# Altium project Project Pegasus (12V 10A MD).PrjPcb
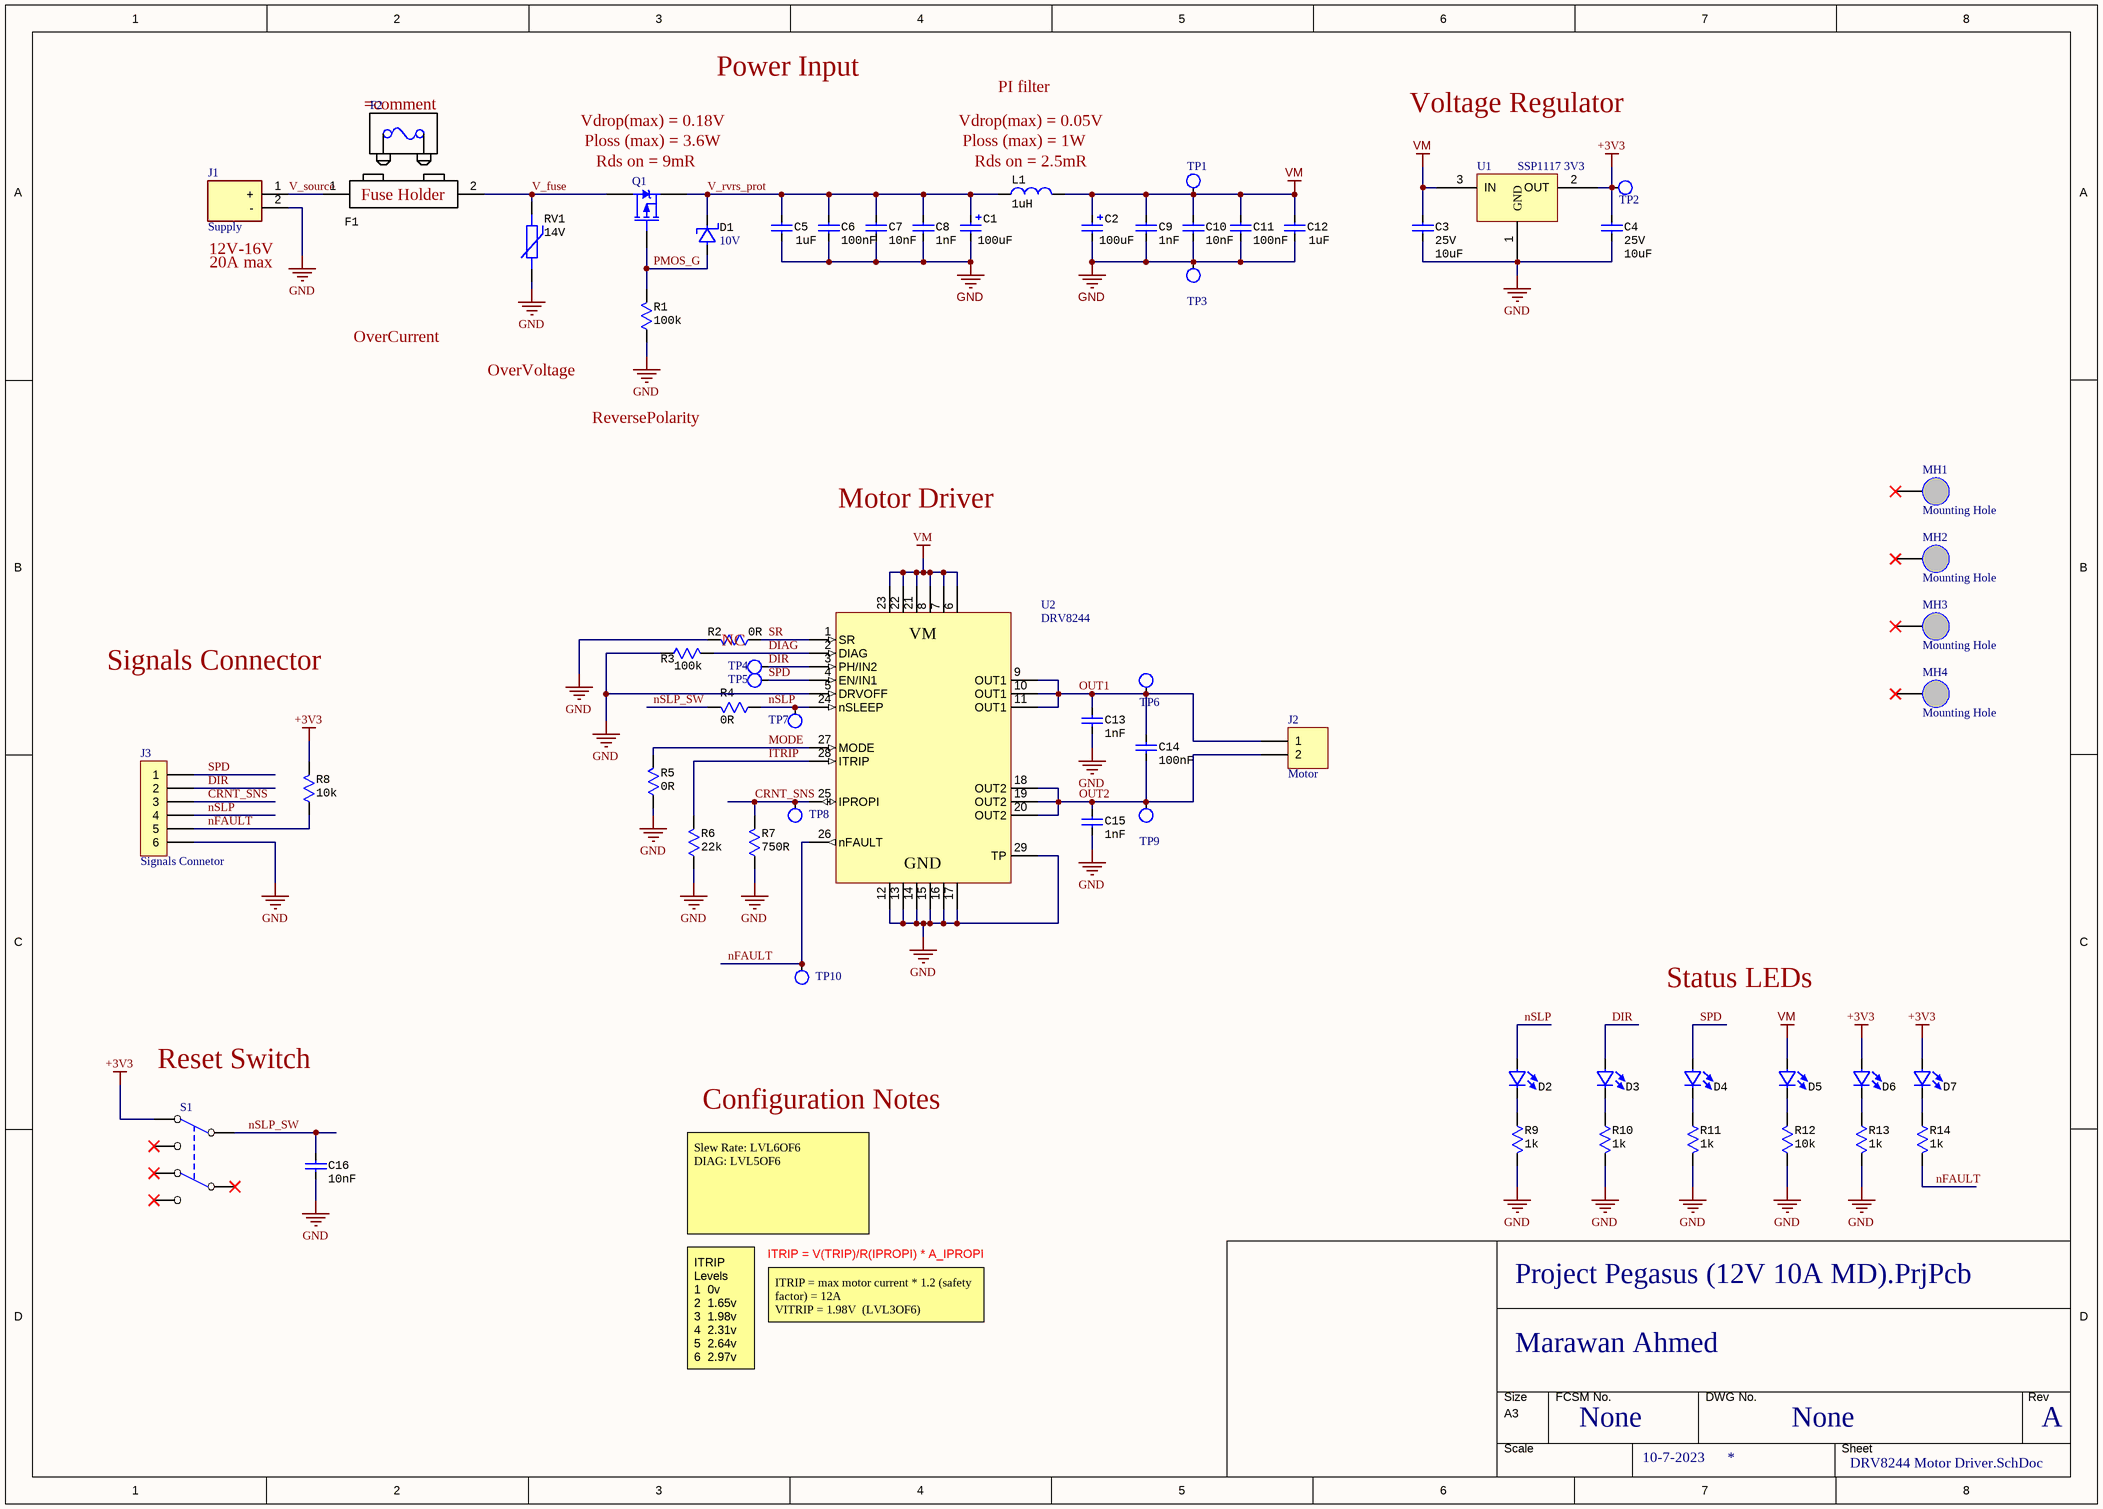
[diagram p0: DRV8244 Motor Driver.SchDoc]
1 sheet, 62 parts. Net scope: global (net labels, ports and power ports of the same name join across sheets).
Board file: DRV8244 Motor Driver.PcbDoc

## Sheet DRV8244 Motor Driver.SchDoc: DRV8244 Motor Driver
size A3; Date: 10-7-2023; Author: Marawan Ahmed; Revision: A; SheetNumber: 1; SheetTotal: 1

### Parts
C1  100uF  [CAP Electrolytic SMD G_10X10.3X10.2(CPOL-EU153CLV-1010)]
C2  100uF  [CAP Electrolytic SMD G_10X10.3X10.2(CPOL-EU153CLV-1010)]
C3  Voltage: 25V  [CAP Ceramic SMD 1206]  (hidden comment: 10uF)
C4  Voltage: 25V  [CAP Ceramic SMD 1206]  (hidden comment: 10uF)
C5  1uF  [CAP Ceramic SMD 0603]
C6  100nF  [CAP Ceramic SMD 0603]
C7  10nF  [CAP Ceramic SMD 0603]
C8  1nF  [CAP Ceramic SMD 0603]
C9  1nF  [CAP Ceramic SMD 0603]
C10  10nF  [CAP Ceramic SMD 0603]
C11  100nF  [CAP Ceramic SMD 0603]
C12  1uF  [CAP Ceramic SMD 0603]
C13  1nF  [CAP Ceramic SMD 0603]
C14  100nF  [CAP Ceramic SMD 0603]
C15  1nF  [CAP Ceramic SMD 0603]
C16  10nF  [CAP Ceramic SMD 0603]
D1  10V  [Diode Single SMD SOD123]
D2  (no value)  [LED SMD 0805G]
D3  (no value)  [LED SMD 0805G]
D4  (no value)  [LED SMD 0805G]
D5  (no value)  [LED SMD 0805R]
D6  (no value)  [LED SMD 0805R]
D7  (no value)  [LED SMD 0805B]
F1  XF-508P-A  [FUSE-TH_L19.8-W7.0_XF-508P-A]  (value not drawn)
F2  25A  (value not drawn)  (mechanical)
J1  Supply  [XT60PW-M]
J2  Motor  [Connector screw terminal Block TH 1x2 9.5 WJ46-B]
J3  Signals Connetor  [XH-6/2.5mm]
L1  1uH  [IND SMD SRP1265A]
MH1  Mounting Hole  [Connector Mounting hole th 3.5mm]  (no BOM)
MH2  Mounting Hole  [Connector Mounting hole th 3.5mm]  (no BOM)
MH3  Mounting Hole  [Connector Mounting hole th 3.5mm]  (no BOM)
MH4  Mounting Hole  [Connector Mounting hole th 3.5mm]  (no BOM)
Q1  HYG110P04LQ2C2  [PQFN 5x6]  (value not drawn)
R1  100k  [RES SMD 0603]
R2  0R  [RES SMD 0603]
R3  100k  [RES SMD 0603]
R4  0R  [RES SMD 0603]
R5  0R  [RES SMD 0603]
R6  22k  [RES SMD 0603]
R7  750R  [RES SMD 0603]
R8  value 10k  [RES SMD 0603]  (hidden comment: 10kR)
R9  value 1k  [RES SMD 0603]  (hidden comment: 1kR)
R10  value 1k  [RES SMD 0603]  (hidden comment: 1kR)
R11  value 1k  [RES SMD 0603]  (hidden comment: 1kR)
R12  value 10k  [RES SMD 0603]  (hidden comment: 10kR)
R13  value 1k  [RES SMD 0603]  (hidden comment: 1kR)
R14  value 1k  [RES SMD 0603]  (hidden comment: 1kR)
RV1  14V  [VAR 7.5mm]
S1  PB-22E86C  [SWP-KFT DIP-8X8]  (value not drawn)
TP1  TestPoint  [TestPoint Surface 0.8mm]  (value not drawn)  (no BOM)
TP2  TestPoint  [TestPoint Surface 0.8mm]  (value not drawn)  (no BOM)
TP3  TestPoint  [TestPoint Surface 0.8mm]  (value not drawn)  (no BOM)
TP4  TestPoint  [TestPoint Surface 0.8mm]  (value not drawn)  (no BOM)
TP5  TestPoint  [TestPoint Surface 0.8mm]  (value not drawn)  (no BOM)
TP6  TestPoint  [TestPoint Surface 0.8mm]  (value not drawn)  (no BOM)
TP7  TestPoint  [TestPoint Surface 0.8mm]  (value not drawn)  (no BOM)
TP8  TestPoint  [TestPoint Surface 0.8mm]  (value not drawn)  (no BOM)
TP9  TestPoint  [TestPoint Surface 0.8mm]  (value not drawn)  (no BOM)
TP10  TestPoint  [TestPoint Surface 0.8mm]  (value not drawn)  (no BOM)
U1  SSP1117 3V3  [Linear reagulator SMD AMS1117]
U2  DRV8244  [DRV8244]

### Nets
+3V3: C4.1 D6.1 D7.1 R8.2 S1.1 TP2.1 U1.2(OUT)
GND: C1.2 C2.2 C3.2 C4.2 C5.2 C6.2 C7.2 C8.2 C9.2 C10.2 C11.2 C12.2 C13.2 C15.2 C16.2 J1.2(-) J3.6 R1.1 R2.2 R3.1 R5.1 R6.1 R7.1 R9.2 R10.2 R11.2 R12.1 R13.2 RV1.1 TP3.1 U1.1(GND) U2.5(DRVOFF) U2.12(GND) U2.13(GND) U2.14(GND) U2.15(GND) U2.16(GND) U2.17(GND) U2.29(TP)
VM: C2.1 C3.1 C9.1 C10.1 C11.1 C12.1 D5.1 L1.1 TP1.1 U1.3(IN) U2.6(VM) U2.7(VM) U2.8(VM) U2.21(VM) U2.22(VM) U2.23(VM)
CRNT_SNS: J3.3 R7.2 TP8.1 U2.25(IPROPI)
DIAG: R3.2 U2.2(DIAG)
DIR: D3.1 J3.2 TP4.1 U2.3(PH/IN2)
ITRIP: R6.2 U2.28(ITRIP)
MODE: R5.2 U2.27(MODE)
nFAULT: J3.5 R8.1 R14.2 TP10.1 U2.26(nFAULT)
nSLP: D2.1 J3.4 R4.1 TP7.1 U2.24(nSLEEP)
nSLP_SW: C16.1 R4.2 S1.2
OUT1: C13.1 C14.1 J2.1 TP6.1 U2.9(OUT1) U2.10(OUT1) U2.11(OUT1)
OUT2: C14.2 C15.1 J2.2 TP9.1 U2.18(OUT2) U2.19(OUT2) U2.20(OUT2)
PMOS_G: D1.1 Q1.1(G) R1.2
SPD: D4.1 J3.1 TP5.1 U2.4(EN/IN1)
SR: R2.1 U2.1(SR)
V_fuse: F1.2 Q1.2(D) RV1.2
V_rvrs_prot: C1.1 C5.1 C6.1 C7.1 C8.1 D1.2 L1.2 Q1.3(S)
V_source: F1.1 J1.1(+)
NetD2_2: D2.2 R9.1
NetD3_2: D3.2 R10.1
NetD4_2: D4.2 R11.1
NetD5_2: D5.2 R12.2
NetD6_2: D6.2 R13.1
NetD7_2: D7.2 R14.1

Not connected (* = marked no-connect by the designer): MH1 1*; MH2 1*; MH3 1*; MH4 1*; S1 3* 4* 5* 6*

### Notes on the sheet
- Power Input
- PI filter
- (near Q1) Rds on = 9mR
- (near Q1) Ploss (max) = 3.6W
- Vdrop(max) = 0.18V
- (near L1) Ploss (max) = 1W
- (near L1) Rds on = 2.5mR
- Vdrop(max) = 0.05V
- Voltage Regulator
- (near J1) 12V-16V
- (near J1) 20A max
- OverCurrent
- OverVoltage
- ReversePolarity
- Motor Driver
- (near R2) NC
- Signals Connector
- Status LEDs
- (near S1) Reset Switch
- Configuration Notes
- Slew Rate: LVL6OF6
  DIAG: LVL5OF6
- ITRIP = V(TRIP)/R(IPROPI) * A_IPROPI
- ITRIP = max motor current * 1.2 (safety factor) = 12A
  VITRIP = 1.98V  (LVL3OF6)
- ITRIP Levels
  1  0v
  2  1.65v
  3  1.98v
  4  2.31v
  5  2.64v
  6  2.97v
- None
- THIS DOCUMENT AND THE DATA DISCLOSED HEREIN OR
- HEREWITH IS THE PROPERTY OF ALTIUM LIMITED AND MAY
- DWG NO:
- REVISION
- REV:
- DESCRIPTION
- DATE
- APPROVED
- BE FREELY DISTRIBUTED IN WHOLE. NO RIGHTS ARE
- RESERVED OR EXPRESS OR IMPLIED WARANTEE GIVEN.
- ENG:
- APPROVALS
- PROJECT
- DSN:
- CHK:
- REFERENCE DOCUMENTS
- PROJECT REVISION:
- TITLE
- DOCUMENT REVISION:
- DESIGN ITEM:
- BOM:
- FAB DWG:
- PCB DWG:
- ASSY DWG:
- SCALE:
- A3
- SIZE
- CAGE CODE
- FILE NAME
- DWG NO.
- SHEET
- OF
- REV
- (in symbol Fuse Automotive holder) Fuse Holder

### Library data of the parts
C1 C2 = CAP ELEC 100uF 68V: -40℃~+105℃ 2000hrs@105℃ 100uF 10.2mm 63V 10mm ±20% SMD,D10xL10.2mm Aluminum Electrolytic Capacitors - SMD ROHS; Manufacturer: ROQANG; Manufacturer Part Number: RT1J101M1010; ComponentLink1Description: Datasheet; ComponentLink1URL: https://datasheet.lcsc.com/lcsc/1809061214_Nichicon-UWX1C101MCL1GB_C111600.pdf; Supplier: LCSC; Supplier Part Number: C280414; Capacitance: 100uF
C3 C4 = CAP 1206 10uF 25V: Ceramic capacitor SMD-1206 10000nF (10uF) /25V X7R# K 10%, Samsung, RoHS/4k/; Manufacturer Part Number: CL31B106KAHNNNE; Dielectric: X7R; Manufacturer: Samsung; RoHS: Yes; Category: Ceramic Capacitors; Stock 1: 663420; Pricing 1: 20=0.033200, 200=0.025500, 600=0.022100, 2000=0.019600, 10000=0.018600, 20000=0.017900 (AUD); Mount: Surface Mount; Case/Package: 1206; Case Code (Imperial): 1206; Case Code (Metric): 3216; Min Operating Temperature: -55°C; Max Operating Temperature: 125°C; Capacitance: 10uF; Tolerance: 10%; Voltage Rating: 25V; Packaging: Tape and Reel; Package Quantity: 1; Length: 3.2mm; Width: 0.063inch; Height: 1.6mm; Thickness: 0.071inch; RoHS Compliant: Yes; ComponentLink1URL: https://datasheet.ciiva.com/25795/cl31b106kahnnne-25795260.pdf?src-supplier=Digi-Key; ComponentLink1Description: https://datasheet.ciiva.com/25795/cl31b106kahnnne-25795260.pdf?src-supplier=Digi-Key; ComponentLink2URL: https://datasheet.ciiva.com/26838/getdatasheetpartid-356415-26838914.pdf?src-supplier=Verical; ComponentLink2Description: https://datasheet.ciiva.com/26838/getdatasheetpartid-356415-26838914.pdf?src-supplier=Verical; ComponentLink3URL: https://datasheet.ciiva.com/16498/cl03a105mq3csnc-16498474.pdf?src-supplier=Future+Electronics; ComponentLink3Description: https://datasheet.ciiva.com/16498/cl03a105mq3csnc-16498474.pdf?src-supplier=Future+Electronics; Value: 10uF; Depth: 1.6mm; ComponentLink10URL: https://datasheet.ciiva.com/25795/cl31b106kahnnne-25795260.pdf?src-supplier=Digi-Key; ComponentLink10Description: https://datasheet.ciiva.com/25795/cl31b106kahnnne-25795260.pdf?src-supplier=Digi-Key; ComponentLink11URL: https://datasheet.ciiva.com/26838/getdatasheetpartid-356415-26838914.pdf?src-supplier=Verical; ComponentLink11Description: https://datasheet.ciiva.com/26838/getdatasheetpartid-356415-26838914.pdf?src-supplier=Verical; ComponentLink12URL: https://datasheet.ciiva.com/16498/cl03a105mq3csnc-16498474.pdf?src-supplier=Future+Electronics; ComponentLink12Description: https://datasheet.ciiva.com/16498/cl03a105mq3csnc-16498474.pdf?src-supplier=Future+Electronics; Series: CL; Construction: Flat; Radiation Hardening: No; Supplier: LCSC; Supplier Part Number: C14860
C5 C12 = CAP 0603 1uF 50V: 0603 1 uF 50 V ±10% Tolerance X5R SMT Multilayer Ceramic Capacitor; Manufacturer: Murata; Manufacturer Part Number: GRM188R61H105KAALD; Voltage Rating: 50V; Dielectric: X7R; RoHS: Yes; Category: Ceramic Capacitors; Stock 1: 2200; Pricing 1: 50=0.01970, 500=0.01600, 1500=0.01390, 5000=0.01050, 25000=0.00960, 50000=0.00910 (USD); Mount: Surface Mount; Case/Package: 0603; Case Code (Metric): 1608; Case Code (Imperial): 0603; Weight: 0.000222oz; Material: Ceramic; Min Operating Temperature: -55°C; Max Operating Temperature: 85°C; Capacitance: 1uF; Tolerance: 10%; Packaging: Tape and Reel; Voltage Rating (DC): 50V; Package Quantity: 4000; Termination: SMD/SMT; Series: GRM; Resistor Type: Ceramic; Construction: Flat; Length: 1.6mm; Width: 0.8mm; Height: 0.8mm; Thickness: 0.035inch; Depth: 0.8mm; Radiation Hardening: No; RoHS Compliant: Yes; Lead Free: Lead Free; REACH SVHC: No SVHC; ComponentLink1URL: https://datasheet.ciiva.com/23628/1522414-23628576.pdf?src-supplier=Newark; ComponentLink1Description: https://datasheet.ciiva.com/23628/1522414-23628576.pdf?src-supplier=Newark; ComponentLink2URL: https://datasheet.ciiva.com/22706/1747450-22706788.pdf?src-supplier=Element14; ComponentLink2Description: https://datasheet.ciiva.com/22706/1747450-22706788.pdf?src-supplier=Element14; ComponentLink3URL: https://datasheet.ciiva.com/14116/grmseries-highdielectrictype-eng-14116381.pdf?src-supplier=Distrelec; ComponentLink3Description: https://datasheet.ciiva.com/14116/grmseries-highdielectrictype-eng-14116381.pdf?src-supplier=Distrelec; ComponentLink4URL: https://datasheet.ciiva.com/7719/1747450-7719046.pdf?src-supplier=Element14; ComponentLink4Description: https://datasheet.ciiva.com/7719/1747450-7719046.pdf?src-supplier=Element14; Voltage: 50V; Value: 1uF; Supplier: LCSC; Supplier Part Number: C77386
C6 C11 C14 = CAP 0603 100nF 100V: 0603 0.1 uF 100 V ±10% Tolerance X7R Multilayer Ceramic Capacitor; Manufacturer: Yageo; Manufacturer Part Number: CC0603KRX7R0BB104; Voltage Rating: 100V; Supplier: LCSC; Supplier Part Number: C113803; RoHS: Yes; Category: Ceramic Capacitors; Stock 1: 6927977; Pricing 1: 1=0.17000, 10=0.11900, 50=0.06760, 100=0.05590, 500=0.03922, 1000=0.03246 (USD); Mount: Surface Mount; Case/Package: 0603; Case Code (Metric): 1608; Case Code (Imperial): 0603; Weight: 7.1E-05oz; Min Operating Temperature: -55°C; Max Operating Temperature: 125°C; Package Quantity: 4000; Capacitance: 100nF; Tolerance: 10%; Packaging: Tape and Reel; Dielectric: X7R; Termination: SMD/SMT; Resistor Type: Ceramic; Voltage Rating (DC): 100V; Series: CC; Length: 0.063inch; Width: 0.031inch; Thickness: 0.035inch; Depth: 0.8mm; Lead Free: Lead Free; RoHS Compliant: Yes; ComponentLink1URL: https://datasheet.ciiva.com/6277/mlccorderingcode-6277082.pdf?src-supplier=Digi-Key; ComponentLink1Description: https://datasheet.ciiva.com/6277/mlccorderingcode-6277082.pdf?src-supplier=Digi-Key; ComponentLink2URL: https://datasheet.ciiva.com/6277/mlccorderingcode-6277081.pdf?src-supplier=Digi-Key; ComponentLink2Description: https://datasheet.ciiva.com/6277/mlccorderingcode-6277081.pdf?src-supplier=Digi-Key; ComponentLink3URL: https://datasheet.ciiva.com/6277/mlccorderingcode-6277030.pdf?src-supplier=Digi-Key; ComponentLink3Description: https://datasheet.ciiva.com/6277/mlccorderingcode-6277030.pdf?src-supplier=Digi-Key
C7 C10 C16 = CAP 0603 10nF 50V: 0603 10nF 50V ±10% Tolerance X7R Surface Mount Multilayer Ceramic Capacitor; Manufacturer: Kyocera AVX; Manufacturer Part Number: 06035C103K4T2A; Dissipation Factor: 2.5%; RoHS: Yes; Category: Ceramic Capacitors; Stock 1: 4600; Pricing 1: 50=0.012500, 500=0.010300, 1500=0.009100, 5000=0.008400, 25000=0.007800, 50000=0.007400 (AUD); Mount: Surface Mount; Case/Package: 0603; Number of Pins: 2; Case Code (Metric): 1608; Case Code (Imperial): 0603; Contact Plating: Tin,Matte; Min Operating Temperature: -55°C; Max Operating Temperature: 125°C; Tolerance: 10%; Packaging: Tape and Reel; Dielectric: X7R; Package Quantity: 1; Voltage Rating (DC): 50V; Termination: SMD/SMT; Series: -; Construction: Flat; Length: 1.6mm; Width: 0.032inch; Height: 0.9mm; Depth: 0.81mm; Thickness: 0.035inch; Ratings: AEC-Q200; Radiation Hardening: No; RoHS Compliant: Yes; Lead Free: Lead Free; REACH SVHC: No SVHC; ComponentLink1URL: https://datasheet.ciiva.com/16425/cauto-16425973.pdf?src-supplier=Future+Electronics; ComponentLink1Description: https://datasheet.ciiva.com/16425/cauto-16425973.pdf?src-supplier=Future+Electronics; ComponentLink2URL: https://datasheet.ciiva.com/206/cauto-206886.pdf?src-supplier=Digi-Key; ComponentLink2Description: https://datasheet.ciiva.com/206/cauto-206886.pdf?src-supplier=Digi-Key; ComponentLink3URL: https://datasheet.ciiva.com/7614/cauto-7614648.pdf?src-supplier=Digi-Key; ComponentLink3Description: https://datasheet.ciiva.com/7614/cauto-7614648.pdf?src-supplier=Digi-Key; ComponentLink4URL: https://datasheet.ciiva.com/14891/cauto-14891051.pdf?src-supplier=Digi-Key; ComponentLink4Description: https://datasheet.ciiva.com/14891/cauto-14891051.pdf?src-supplier=Digi-Key; ComponentLink5URL: https://datasheet.ciiva.com/7855/88813-7855228.pdf?src-supplier=Element14; ComponentLink5Description: https://datasheet.ciiva.com/7855/88813-7855228.pdf?src-supplier=Element14; ComponentLink6URL: https://datasheet.ciiva.com/14891/cauto-14891052.pdf?src-supplier=Digi-Key; ComponentLink6Description: https://datasheet.ciiva.com/14891/cauto-14891052.pdf?src-supplier=Digi-Key; ComponentLink7URL: https://datasheet.ciiva.com/11499/cauto-11499678.pdf?src-supplier=Avnet; ComponentLink7Description: https://datasheet.ciiva.com/11499/cauto-11499678.pdf?src-supplier=Avnet; Capacitance: 10nF; Voltage Rating: 50V; Supplier: LCSC; Supplier Part Number: C513325
C8 C9 C13 C15 = CAP 0603 1nF 50V: CAP CER 1100PF 50V C0G/NP0 0603; Manufacturer: YAGEO; Manufacturer Part Number: CC0603KRX7R9BB102; ComponentLink1URL: https://datasheet.ciiva.com/133/product-133472.pdf?src-supplier=Digi-Key; ComponentLink1Description: https://datasheet.ciiva.com/133/product-133472.pdf?src-supplier=Digi-Key; ComponentLink2URL: https://datasheet.ciiva.com/133/partnumbering-e-01-133471.pdf?src-supplier=Digi-Key; ComponentLink2Description: https://datasheet.ciiva.com/133/partnumbering-e-01-133471.pdf?src-supplier=Digi-Key; ComponentLink3URL: https://datasheet.ciiva.com/133/partnumbering-e-01-133473.pdf?src-supplier=Digi-Key; ComponentLink3Description: https://datasheet.ciiva.com/133/partnumbering-e-01-133473.pdf?src-supplier=Digi-Key; ComponentLink4URL: https://datasheet.ciiva.com/11621/product-11621253.pdf?src-supplier=Avnet; ComponentLink4Description: https://datasheet.ciiva.com/11621/product-11621253.pdf?src-supplier=Avnet; Capacitance: 1nF; Supplier: LCSC; Supplier Part Number: C100040; Voltage Rating: 50V
D1 = DDZ10C-7: ±2.5% Single 470mW 10V SOD-123 Zener Diodes ROHS; Manufacturer: Diodes Incorporated; Manufacturer Part Number: DDZ10C-7; Supplier: LCSC; Supplier Part Number: C3025207; ZenerVoltage: 10V
D2-D4 = LED 0805 Emerald: emerald 0805 Light Emitting Diodes (LED) ROHS; Manufacturer: FOSHAN Nationstar Optoelectronics; Manufacturer Part Number: NCD0805G1; RoHS: No; Category: Uncategorized; Stock 1: 432460; Pricing 1: 20=0.01910, 200=0.01510, 600=0.01290, 3000=0.01160, 9000=0.01050, 21000=0.00990 (USD); Supplier: LCSC; Supplier Part Number: C84260
D5 D6 = LED 0805 Red: red 0805 Light Emitting Diodes (LED) ROHS; Manufacturer: FOSHAN Nationstar Optoelectronics; Manufacturer Part Number: NCD0805R1; RoHS: No; Category: Uncategorized; Stock 1: 1189900; Pricing 1: 50=0.01160, 500=0.00900, 3000=0.00780, 6000=0.00700, 24000=0.00660, 51000=0.00640 (USD); Supplier: LCSC; Supplier Part Number: C84256
D7 = LED 0805 Blue: blue 0805 Light Emitting Diodes (LED) ROHS; Manufacturer: FOSHAN Nationstar Optoelectronics; Manufacturer Part Number: NCD0805B2; RoHS: No; Category: Uncategorized; Stock 1: 103180; Pricing 1: 20=0.02090, 200=0.01660, 600=0.01420, 3000=0.01280, 9000=0.01150, 21000=0.01090 (USD); Supplier: LCSC; Supplier Part Number: C84259
F1 = Fuse Automotive holder: Plugin Fuse Holders ROHS; Manufacturer: XFCN; Package: Plugin; Supplier: LCSC; Supplier Part Number: C2935469; Manufacturer Part Number: XF-508P-A
F2 = Fuse Automotive 25A 0287025.PXCN: 32V Fuse Automotive Holder Blade 25A - Automotive Fuses ROHS; Manufacturer: Littelfuse; Manufacturer Part Number: 0287025.PXCN; Supplier: LCSC; Supplier Part Number: C116701; Current: 25A
J1 = XT60PW-M: Power Connectors ROHS; Manufacturer: Changzhou Amass Elec; Manufacturer Part Number: XT60PW-M; Supplier: LCSC; Supplier Part Number: C98732
J2 = Barrier Block 1x2 9.5mm with cover: -40℃~+105℃ 32A 750V Black 1x2P Corner pin Barrier Block 12~22 Straight pin 2 1 9.5mm 4 Straight,P=9.5mm Barrier Terminal Blocks ROHS; Manufacturer: DIBO; Manufacturer Part Number: DBT50G-9.5-2P; ComponentLink1URL: https://datasheet.ciiva.com/824/6912141100xx-824001.pdf?src-supplier=Digi-Key; ComponentLink1Description: https://datasheet.ciiva.com/824/6912141100xx-824001.pdf?src-supplier=Digi-Key; ComponentLink2URL: https://datasheet.ciiva.com/48693/001088618-da-01-en-wr-tbl-terminal-block2141-691214110002-48693195.pdf?src-supplier=Conrad; ComponentLink2Description: https://datasheet.ciiva.com/48693/001088618-da-01-en-wr-tbl-terminal-block2141-691214110002-48693195.pdf?src-supplier=Conrad; Supplier: LCSC; Supplier Part Number: C395958
J3 = JST XH2.5mm 1x6P: 1x6P XH 1 2.5mm 6 Brass Plugin,P=2.5mm Wire To Board / Wire To Wire Connector ROHS; Manufacturer: JST Sales America; Manufacturer Part Number: B6B-XH-A(LF)(SN); Supplier: LCSC; Supplier Part Number: C144397
L1 = MHCC12050-1R0M-R7: 29A 1uH ±20% 37A SMD Power Inductors ROHS; Manufacturer: Chilisin Elec; Manufacturer Part Number: MHCC12050-1R0M-R7; Supplier: LCSC; Supplier Part Number: C329553; Inductance: 1uH
Q1 = HYG110P04LQ2C2: 40V 55A 62.5W 9mΩ@10V,20A P Channel PDFN-8(5.9x5.2) MOSFETs ROHS; Manufacturer: HUAYI; Supplier: LCSC; Manufacturer Part Number: HYG110P04LQ2C2; ComponentLink6URL: http://www.irf.com/product-info/datasheets/data/irfr7440pbf.pdf?src-supplier=Newark; ComponentLink6Description: http://www.irf.com/product-info/datasheets/data/irfr7440pbf.pdf?src-supplier=Newark; Supplier Part Number: C2891580
R1 R3 = RES 0603 100k 1%: RES SMD 100K OHM 1% 1/10W 0603; Manufacturer: Panasonic; Manufacturer Part Number: ERJ3EKF1003V; Temperature Coefficient: 100ppm/°C; Power Rating: 100mW; Voltage Rating: 75V; RoHS: Yes; Category: Chip SMD Resistors; Mount: Surface Mount; Case/Package: 0603; Number of Pins: 2; Case Code (Imperial): 0603; Case Code (Metric): 1608; Contact Plating: Tin; Weight: 7.1E-05oz; Size Code: 0603; Min Operating Temperature: -55°C; Max Operating Temperature: 155°C; Tolerance: 1%; Packaging: Tape and Reel; Resistor Type: Thick Film; Series: ERJ; Termination: SMD/SMT; Number of Terminations: 2; Max Power Dissipation: 100mW; Features: Automotive AEC-Q200; Construction: Rectangular; Package Quantity: 5000; Resistance Tolerance: 1%; Voltage Rating (DC): 75V; Length: 1.6mm; Width: 0.8mm; Height: 0.022inch; Depth: 0.8mm; Radiation Hardening: No; RoHS Compliant: Yes; Military Standard: Not; REACH SVHC: No SVHC; Lead Free: Lead Free; ComponentLink1URL: https://datasheet.ciiva.com/34303/1987476-34303566.pdf?src-supplier=Jameco; ComponentLink1Description: https://datasheet.ciiva.com/34303/1987476-34303566.pdf?src-supplier=Jameco; ComponentLink2URL: https://datasheet.ciiva.com/16770/70260748-16770253.pdf?src-supplier=Allied+Electronics; ComponentLink2Description: https://datasheet.ciiva.com/16770/70260748-16770253.pdf?src-supplier=Allied+Electronics; ComponentLink3URL: https://datasheet.ciiva.com/16740/aoa0000ce2-16740662.pdf?src-supplier=Future+Electronics; ComponentLink3Description: https://datasheet.ciiva.com/16740/aoa0000ce2-16740662.pdf?src-supplier=Future+Electronics; ComponentLink4URL: https://datasheet.ciiva.com/15158/getdatasheetpartid-247527-15158907.pdf?src-supplier=Verical; ComponentLink4Description: https://datasheet.ciiva.com/15158/getdatasheetpartid-247527-15158907.pdf?src-supplier=Verical; ComponentLink5URL: https://datasheet.ciiva.com/30133/aoa0000ce2-30133845.pdf?src-supplier=Onlinecomponents.com; ComponentLink5Description: https://datasheet.ciiva.com/30133/aoa0000ce2-30133845.pdf?src-supplier=Onlinecomponents.com; Resistance: 100k; Stock: 373100; Pricing: 50=0.00790, 500=0.00640, 1500=0.00550, 5000=0.00500, 25000=0.00460, 50000=0.00430 (USD); Supplier Part Number: C189597; Supplier: LCSC
R2 R4 R5 = RES 0603 0R 1%: ERJ Series 0603 0 Ohm 0.05 W Jumper Surface Mount Thick Film Chip Resistor; Manufacturer: Panasonic; Manufacturer Part Number: ERJ-3GEY0R00V; Tolerance: 1%; Max Power Dissipation: 100mW; Voltage Rating (DC): 50V; Temperature Coefficient: 600ppm/°C; Voltage Rating: 75V; Value: 0R; RoHS: Yes; Category: Chip SMD Resistors; Stock 1: 3440000; Pricing 1: 5000=0.00480 (USD); Mount: Surface Mount; Case/Package: 0603; Case Code (Metric): 1608; Case Code (Imperial): 0603; Contact Plating: Tin; Size Code: 0603; Min Operating Temperature: -55°C; Max Operating Temperature: 155°C; Packaging: Tape and Reel; Resistance: 0R; Resistor Type: Thick Film; Number of Terminations: 2; Series: ERJ; Power Rating: 100mW; Package Quantity: 1; Construction: Rectangular; Termination: SMD/SMT; Features: Automotive AEC-Q200; Technology: THICK FILM; Length: 1.6mm; Width: 0.031inch; Height: 0.45mm; Depth: 0.8mm; Radiation Hardening: No; RoHS Compliant: Yes; Lead Free: Lead Free; Military Standard: Not; REACH SVHC: No SVHC; ComponentLink1URL: https://datasheet.ciiva.com/27055/1935748-27055113.pdf?src-supplier=Jameco; ComponentLink1Description: https://datasheet.ciiva.com/27055/1935748-27055113.pdf?src-supplier=Jameco; ComponentLink2URL: https://datasheet.ciiva.com/11808/0900766b80f806dd-11808207.pdf?src-supplier=RSComponents; ComponentLink2Description: https://datasheet.ciiva.com/11808/0900766b80f806dd-11808207.pdf?src-supplier=RSComponents; ComponentLink3URL: https://datasheet.ciiva.com/48532/aoa0000ce1-48532165.pdf?src-supplier=Avnet; ComponentLink3Description: https://datasheet.ciiva.com/48532/aoa0000ce1-48532165.pdf?src-supplier=Avnet; ComponentLink4URL: https://datasheet.ciiva.com/43460/1678796-43460647.pdf?src-supplier=Farnell; ComponentLink4Description: https://datasheet.ciiva.com/43460/1678796-43460647.pdf?src-supplier=Farnell; ComponentLink5URL: https://datasheet.ciiva.com/28695/1678796-28695833.pdf?src-supplier=Element14; ComponentLink5Description: https://datasheet.ciiva.com/28695/1678796-28695833.pdf?src-supplier=Element14; ComponentLink6URL: https://datasheet.ciiva.com/5959/1678796-5959707.pdf?src-supplier=Farnell; ComponentLink6Description: https://datasheet.ciiva.com/5959/1678796-5959707.pdf?src-supplier=Farnell; ComponentLink7URL: https://datasheet.ciiva.com/16834/aoa0000ce1-16834828.pdf?src-supplier=Future+Electronics; ComponentLink7Description: https://datasheet.ciiva.com/16834/aoa0000ce1-16834828.pdf?src-supplier=Future+Electronics; ComponentLink8URL: https://datasheet.ciiva.com/46377/1678796-46377868.pdf?src-supplier=Element14; ComponentLink8Description: https://datasheet.ciiva.com/46377/1678796-46377868.pdf?src-supplier=Element14; ComponentLink9URL: https://datasheet.ciiva.com/30199/4aoa0000ce1-30199822.pdf?src-supplier=Onlinecomponents.com; ComponentLink9Description: https://datasheet.ciiva.com/30199/4aoa0000ce1-30199822.pdf?src-supplier=Onlinecomponents.com; ComponentLink10URL: https://datasheet.ciiva.com/9198/aoa0000ce1-9198975.pdf?src-supplier=Avnet; ComponentLink10Description: https://datasheet.ciiva.com/9198/aoa0000ce1-9198975.pdf?src-supplier=Avnet; ComponentLink11URL: https://datasheet.ciiva.com/16758/70255313-16758527.pdf?src-supplier=Allied+Electronics; ComponentLink11Description: https://datasheet.ciiva.com/16758/70255313-16758527.pdf?src-supplier=Allied+Electronics; ComponentLink12URL: https://datasheet.ciiva.com/22730/1678796-22730749.pdf?src-supplier=Element14; ComponentLink12Description: https://datasheet.ciiva.com/22730/1678796-22730749.pdf?src-supplier=Element14; Supplier: LCSC; Stock: 79900; Pricing: 50=0.00820, 500=0.00670, 1500=0.00590, 5000=0.00540, 25000=0.00500, 50000=0.00480 (USD); Supplier Part Number: C716999
R6 = RES 0603 22k 1%: 100mW Thick Film Resistors ±5% ±200ppm/℃ 22kΩ 0603 Chip Resistor - Surface Mount ROHS; Manufacturer: PANASONIC; Manufacturer Part Number: ERJ3GEYJ223V; Parameter 1: *; Supplier: LCSC; Supplier Part Number: C403455; Resistance: 22k
R7 = RES 0603 750R 1%: Res Thick Film 0603 750 Ohm 1% 1/10W ±100ppm/°C Molded SMD Punched Carrier T/R; Manufacturer: Panasonic; Manufacturer Part Number: ERJ-3EKF7500V; Max Power Dissipation: 100mW; Voltage Rating (DC): 50V; Voltage Rating: 75V; RoHS: Yes; Category: Chip SMD Resistors; Mount: Surface Mount; Case/Package: 0603; Case Code (Metric): 1608; Case Code (Imperial): 0603; Contact Plating: Tin; Min Operating Temperature: -55°C; Max Operating Temperature: 155°C; Packaging: Tape and Reel; Resistance: 750R; Tolerance: 1%; Number of Terminations: 2; Temperature Coefficient: 100ppm/°C; Resistor Type: Thick Film; Series: ERJ; Power Rating: 100mW; Features: Automotive AEC-Q200; Package Quantity: 1; Termination: SMD/SMT; Construction: Rectangular; Resistance Tolerance: 1%; Technology: THICK FILM; Length: 1.6mm; Width: 0.031inch; Height: 0.45mm; Depth: 0.8mm; Radiation Hardening: No; RoHS Compliant: Yes; Lead Free: Contains Lead; Military Standard: Not; REACH SVHC: No SVHC; ComponentLink1URL: https://datasheet.ciiva.com/27055/1988381-27055702.pdf?src-supplier=Jameco; ComponentLink1Description: https://datasheet.ciiva.com/27055/1988381-27055702.pdf?src-supplier=Jameco; ComponentLink2URL: https://datasheet.ciiva.com/46386/426256-46386762.pdf?src-supplier=Element14; ComponentLink2Description: https://datasheet.ciiva.com/46386/426256-46386762.pdf?src-supplier=Element14; ComponentLink3URL: https://datasheet.ciiva.com/5868/426256-5868143.pdf?src-supplier=Farnell; ComponentLink3Description: https://datasheet.ciiva.com/5868/426256-5868143.pdf?src-supplier=Farnell; ComponentLink4URL: https://datasheet.ciiva.com/46374/426256-46374007.pdf?src-supplier=Element14; ComponentLink4Description: https://datasheet.ciiva.com/46374/426256-46374007.pdf?src-supplier=Element14; ComponentLink5URL: https://datasheet.ciiva.com/24026/aoa0000ce2-24026079.pdf?src-supplier=Mouser; ComponentLink5Description: https://datasheet.ciiva.com/24026/aoa0000ce2-24026079.pdf?src-supplier=Mouser; ComponentLink6URL: https://datasheet.ciiva.com/16779/70260748-16779334.pdf?src-supplier=Allied+Electronics; ComponentLink6Description: https://datasheet.ciiva.com/16779/70260748-16779334.pdf?src-supplier=Allied+Electronics; ComponentLink7URL: https://datasheet.ciiva.com/16765/70260748-16765239.pdf?src-supplier=Allied+Electronics; ComponentLink7Description: https://datasheet.ciiva.com/16765/70260748-16765239.pdf?src-supplier=Allied+Electronics; ComponentLink8URL: https://datasheet.ciiva.com/30163/aoa0000ce2-30163966.pdf?src-supplier=Onlinecomponents.com; ComponentLink8Description: https://datasheet.ciiva.com/30163/aoa0000ce2-30163966.pdf?src-supplier=Onlinecomponents.com; Value: 750R; Supplier: LCSC; Stock: 31800; Pricing: 50=0.004700, 500=0.003800, 1500=0.003200, 5000=0.002900, 25000=0.002600, 50000=0.002500 (AUD); Supplier Part Number: C403346
R8 R12 = RES 0603 10k 1%: Res Thick Film 0603 10K Ohm 1% 1/10W ±100ppm/°C Molded SMD Punched Carrier T/R; Manufacturer: Panasonic; Manufacturer Part Number: ERJ-3EKF1002V; Max Power Dissipation: 100mW; Voltage Rating: 75V; RoHS: Yes; Category: Chip SMD Resistors; Mount: Surface Mount; Case/Package: 0603; Number of Pins: 2; Case Code (Metric): 1608; Case Code (Imperial): 0603; Contact Plating: Tin; Size Code: 0603; Min Operating Temperature: -55°C; Max Operating Temperature: 155°C; Resistance: 10kR; Packaging: Tape and Reel; Resistor Type: Thick Film; Temperature Coefficient: 100ppm/°C; Tolerance: 1%; Number of Terminations: 2; Series: ERJ; Construction: Rectangular; Power Rating: 100mW; Features: Automotive AEC-Q200; Voltage Rating (DC): 75V; Package Quantity: 1; Resistance Tolerance: 1%; Termination: SMD/SMT; Technology: THICK FILM; Length: 1.6mm; Width: 0.031inch; Height: 0.45mm; Depth: 0.8mm; Radiation Hardening: No; RoHS Compliant: Yes; Military Standard: Not; Lead Free: Lead Free; REACH SVHC: No SVHC; ComponentLink1URL: https://datasheet.ciiva.com/7830/aoa0000ce2-7830729.pdf?src-supplier=Element14; ComponentLink1Description: https://datasheet.ciiva.com/7830/aoa0000ce2-7830729.pdf?src-supplier=Element14; ComponentLink2URL: https://datasheet.ciiva.com/46372/1678782-46372725.pdf?src-supplier=Element14; ComponentLink2Description: https://datasheet.ciiva.com/46372/1678782-46372725.pdf?src-supplier=Element14; ComponentLink3URL: https://datasheet.ciiva.com/28514/426256-28514198.pdf?src-supplier=Element14; ComponentLink3Description: https://datasheet.ciiva.com/28514/426256-28514198.pdf?src-supplier=Element14; ComponentLink4URL: https://datasheet.ciiva.com/24070/aoa0000ce2-24070318.pdf?src-supplier=Mouser; ComponentLink4Description: https://datasheet.ciiva.com/24070/aoa0000ce2-24070318.pdf?src-supplier=Mouser; ComponentLink5URL: https://datasheet.ciiva.com/16759/70260748-16759807.pdf?src-supplier=Allied+Electronics; ComponentLink5Description: https://datasheet.ciiva.com/16759/70260748-16759807.pdf?src-supplier=Allied+Electronics; ComponentLink6URL: https://datasheet.ciiva.com/9194/aoa0000ce2-9194199.pdf?src-supplier=Avnet; ComponentLink6Description: https://datasheet.ciiva.com/9194/aoa0000ce2-9194199.pdf?src-supplier=Avnet; ComponentLink7URL: https://datasheet.ciiva.com/48530/aoa0000ce2-48530988.pdf?src-supplier=Avnet; ComponentLink7Description: https://datasheet.ciiva.com/48530/aoa0000ce2-48530988.pdf?src-supplier=Avnet; ComponentLink8URL: https://datasheet.ciiva.com/30208/aoa0000ce2-30208985.pdf?src-supplier=Onlinecomponents.com; ComponentLink8Description: https://datasheet.ciiva.com/30208/aoa0000ce2-30208985.pdf?src-supplier=Onlinecomponents.com; Supplier: LCSC; Stock: 555600; Pricing: 50=0.010200, 500=0.008400, 1500=0.007300, 5000=0.006100, 25000=0.005500, 50000=0.005400 (AUD); Supplier Part Number: C191124
R9-R11 R13 R14 = RES 0603 1k 1%: Res Thick Film 0603 1K Ohm 1% 1/10W ±100ppm/°C Molded SMD Punched Carrier T/R; Manufacturer: Panasonic; Manufacturer Part Number: ERJ3EKF1001V; Power Rating: 100mW; Voltage Rating: 75V; RoHS: Yes; Category: Chip SMD Resistors; Mount: Surface Mount; Case/Package: 0603; Number of Pins: 2; Case Code (Metric): 1608; Case Code (Imperial): 0603; Contact Plating: Tin; Size Code: 0603; Min Operating Temperature: -55°C; Max Operating Temperature: 155°C; Packaging: Tape and Reel; Resistance: 1kR; Resistor Type: Thick Film; Temperature Coefficient: 100ppm/°C; Series: ERJ; Tolerance: 1%; Number of Terminations: 2; Max Power Dissipation: 100mW; Construction: Rectangular; Features: Automotive AEC-Q200; Package Quantity: 5000; Termination: SMD/SMT; Voltage Rating (DC): 75V; Resistance Tolerance: 1%; Technology: THICK FILM; Length: 1.6mm; Width: 0.8mm; Height: 0.45mm; Depth: 0.8mm; Radiation Hardening: No; RoHS Compliant: Yes; Lead Free: Lead Free; Military Standard: Not; REACH SVHC: No SVHC; ComponentLink1URL: https://datasheet.ciiva.com/7942/aoa0000ce2-7942427.pdf?src-supplier=Element14; ComponentLink1Description: https://datasheet.ciiva.com/7942/aoa0000ce2-7942427.pdf?src-supplier=Element14; ComponentLink2URL: https://datasheet.ciiva.com/46373/1678782-46373340.pdf?src-supplier=Element14; ComponentLink2Description: https://datasheet.ciiva.com/46373/1678782-46373340.pdf?src-supplier=Element14; ComponentLink3URL: https://datasheet.ciiva.com/22673/1678782-22673918.pdf?src-supplier=Element14; ComponentLink3Description: https://datasheet.ciiva.com/22673/1678782-22673918.pdf?src-supplier=Element14; ComponentLink4URL: https://datasheet.ciiva.com/46373/1678782-46373339.pdf?src-supplier=Element14; ComponentLink4Description: https://datasheet.ciiva.com/46373/1678782-46373339.pdf?src-supplier=Element14; ComponentLink5URL: https://datasheet.ciiva.com/24070/aoa0000ce2-24070269.pdf?src-supplier=Mouser; ComponentLink5Description: https://datasheet.ciiva.com/24070/aoa0000ce2-24070269.pdf?src-supplier=Mouser; ComponentLink6URL: https://datasheet.ciiva.com/16768/70260748-16768437.pdf?src-supplier=Allied+Electronics; ComponentLink6Description: https://datasheet.ciiva.com/16768/70260748-16768437.pdf?src-supplier=Allied+Electronics; ComponentLink7URL: https://datasheet.ciiva.com/16774/70260748-16774550.pdf?src-supplier=Allied+Electronics; ComponentLink7Description: https://datasheet.ciiva.com/16774/70260748-16774550.pdf?src-supplier=Allied+Electronics; ComponentLink8URL: https://datasheet.ciiva.com/9198/aoa0000ce2-9198923.pdf?src-supplier=Avnet; ComponentLink8Description: https://datasheet.ciiva.com/9198/aoa0000ce2-9198923.pdf?src-supplier=Avnet; ComponentLink9URL: https://datasheet.ciiva.com/16449/aoa0000ce2-16449065.pdf?src-supplier=Future+Electronics; ComponentLink9Description: https://datasheet.ciiva.com/16449/aoa0000ce2-16449065.pdf?src-supplier=Future+Electronics; ComponentLink10URL: https://datasheet.ciiva.com/48530/aoa0000ce2-48530987.pdf?src-supplier=Avnet; ComponentLink10Description: https://datasheet.ciiva.com/48530/aoa0000ce2-48530987.pdf?src-supplier=Avnet; ComponentLink11URL: https://datasheet.ciiva.com/30063/aoa0000ce2-30063390.pdf?src-supplier=Onlinecomponents.com; ComponentLink11Description: https://datasheet.ciiva.com/30063/aoa0000ce2-30063390.pdf?src-supplier=Onlinecomponents.com; Supplier: LCSC; Stock: 79650; Pricing: 50=0.009600, 500=0.008100, 1500=0.007300, 5000=0.006800, 25000=0.006400, 50000=0.006200 (AUD); Supplier Part Number: C118155
RV1 = VAR TH 14V 18V: Allowable voltage is 14VDC 11VAC / Varistor Voltage 18V (15V~21.6V) / Plugin Varistors ROHS; Manufacturer: VDR Varistor; Manufacturer Part Number: VDR-10D180L; Supplier: LCSC; Supplier Part Number: C283931; MaxVoltage: 14V
S1 = PB-22E86C: No lock Straight DPDT 30V 100000 Times 500mA Plugin Push Switches ROHS; Manufacturer Part Number: G-Switch; Manufacturer: PB-22E86C; Supplier: LCSC; Supplier Part Number: C2848957
U1 = SSP1117 3V3: Fixed Positive LDO Regulator, 3.3V, 1.3V Dropout, Load current 1A, Vin max = 20V; Manufacturer: Shanghai Siproin Microelectronics; Manufacturer Part Number: SSP1117-3.3V; RoHS: No; Category: Uncategorized; Supplier: LCSC; Stock: 56640; Pricing: 5=0.06770, 50=0.05540, 150=0.04900, 500=0.04380, 2500=0.04200, 5000=0.04070 (USD); Supplier Part Number: C277892
U2 = DRV8244: Automotive 40-V, 21-A H-Bridge driver with integrated current sensing and feedback 28-HVSSOP -40 to 125; Manufacturer: Texas Instruments; Manufacturer Part Number: DRV8244SQDGQRQ1; RoHS: No; Category: Integrated Circuits (ICs); Supplier: Digi-Key; Supplier Part Number: 296-DRV8244SQDGQRQ1CT-ND; Stock: 2140; Pricing: 1=6.27, 10=5.662, 25=5.3992, 100=4.688, 250=4.47732, 500=4.08226, 1000=3.55551 (USD)